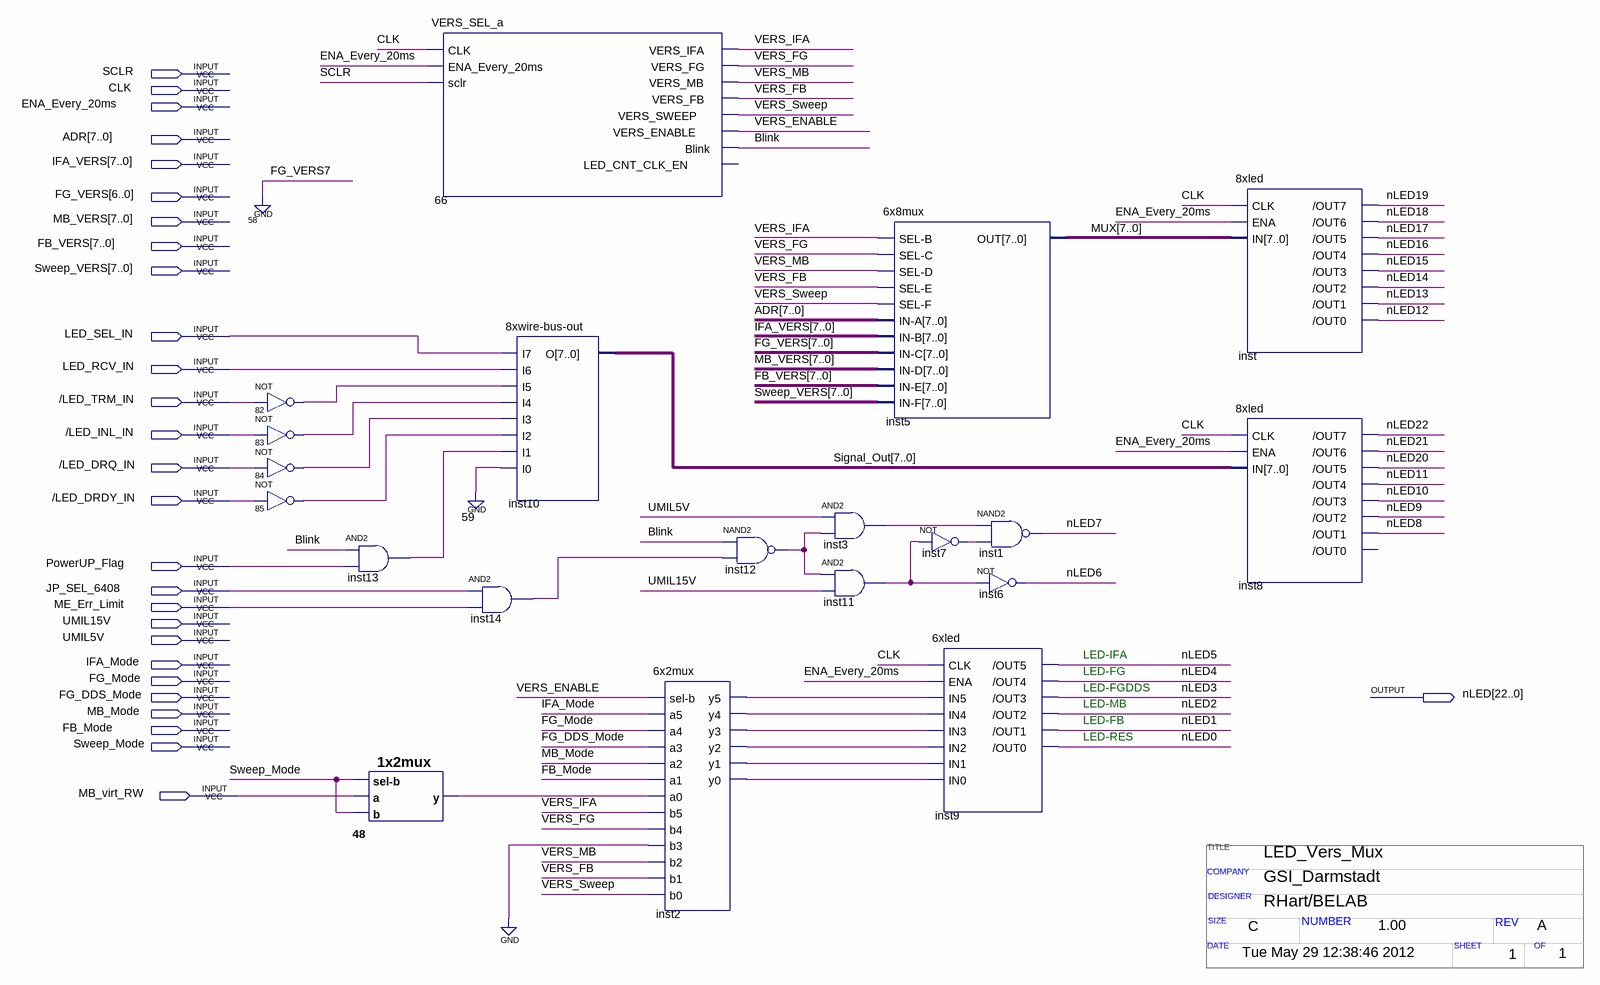
[diagram p0: schematic sheet]
// Quartus schematic led_vers_mux.bdf as structural Verilog: 20 symbols, 28 pins
// Title block: TITLE: LED_Vers_Mux; COMPANY: GSI_Darmstadt; DESIGNER: RHart/BELAB; SIZE: C; NUMBER: 1.00; REV: A; DATE: Tue May 29 12:38:46 2012; SHEET: 1; OF: 1
module led_vers_mux (
  input  SCLR,
  input  CLK,
  input  ENA_Every_20ms,
  input  [7:0] ADR,
  input  [7:0] IFA_VERS,
  input  [6:0] FG_VERS,
  input  [7:0] MB_VERS,
  input  [7:0] FB_VERS,
  input  [7:0] Sweep_VERS,
  input  LED_SEL_IN,
  input  LED_RCV_IN,
  input  \/LED_TRM_IN ,
  input  \/LED_INL_IN ,
  input  \/LED_DRQ_IN ,
  input  \/LED_DRDY_IN ,
  input  PowerUP_Flag,
  input  JP_SEL_6408,
  input  ME_Err_Limit,
  input  UMIL15V,
  input  UMIL5V,
  input  IFA_Mode,
  input  FG_Mode,
  input  FG_DDS_Mode,
  input  MB_Mode,
  input  FB_Mode,
  input  Sweep_Mode,
  input  MB_virt_RW,
  output [22:0] nLED
);

  wire Blink, inst2_y0, inst2_y1, inst2_y2, inst2_y3, inst2_y4, inst2_y5, inst3_out, inst7_out, inst11_out,
       inst12_out, inst13_out, inst14_out, n48_y, n82_out, n83_out, n84_out, n85_out, VERS_ENABLE, VERS_FB,
       VERS_FG, VERS_IFA, VERS_MB, VERS_Sweep;
  wire [7:0] MUX, Signal_Out;

  not u_82 (n82_out, \/LED_TRM_IN );
  not u_83 (n83_out, \/LED_INL_IN );
  not u_84 (n84_out, \/LED_DRQ_IN );
  not u_85 (n85_out, \/LED_DRDY_IN );
  and inst13 (inst13_out, Blink, PowerUP_Flag);
  \1x2mux  u_48 (.\sel-b (Sweep_Mode), .a(MB_virt_RW), .b(Sweep_Mode), .y(n48_y));
  VERS_SEL_a u_66 (
    .CLK(CLK), .ENA_Every_20ms(ENA_Every_20ms), .sclr(SCLR), .VERS_IFA(VERS_IFA), .VERS_FG(VERS_FG),
    .VERS_MB(VERS_MB), .VERS_FB(VERS_FB), .VERS_SWEEP(VERS_Sweep), .VERS_ENABLE(VERS_ENABLE), .Blink(Blink));  // open: LED_CNT_CLK_EN
  \8xwire-bus-out  inst10 (
    .I7(LED_SEL_IN), .I6(LED_RCV_IN), .I5(n82_out), .I4(n83_out), .I3(n84_out), .I2(n85_out),
    .I1(inst13_out), .I0(1'b0), .O(Signal_Out));
  and inst14 (inst14_out, JP_SEL_6408, ME_Err_Limit);
  \6x2mux  inst2 (
    .\sel-b (VERS_ENABLE), .a5(IFA_Mode), .a4(FG_Mode), .a3(FG_DDS_Mode), .a2(MB_Mode), .a1(FB_Mode),
    .a0(n48_y), .b5(VERS_IFA), .b4(VERS_FG), .b3(1'b0), .b2(VERS_MB), .b1(VERS_FB), .b0(VERS_Sweep),
    .y5(inst2_y5), .y4(inst2_y4), .y3(inst2_y3), .y2(inst2_y2), .y1(inst2_y1), .y0(inst2_y0));
  nand inst12 (inst12_out, Blink, inst14_out);
  and inst3 (inst3_out, UMIL5V, inst12_out);
  and inst11 (inst11_out, inst12_out, UMIL15V);
  \6x8mux  inst5 (
    .\SEL-B (VERS_IFA), .\SEL-C (VERS_FG), .\SEL-D (VERS_MB), .\SEL-E (VERS_FB), .\SEL-F (VERS_Sweep),
    .\IN-A (ADR), .\IN-B (IFA_VERS), .\IN-C ({1'b0, FG_VERS}), .\IN-D (MB_VERS), .\IN-E (FB_VERS),
    .\IN-F (Sweep_VERS), .OUT(MUX));
  not inst7 (inst7_out, inst11_out);
  nand inst1 (nLED[7], inst3_out, inst7_out);
  not inst6 (nLED[6], inst11_out);
  \6xled  inst9 (
    .CLK(CLK), .ENA(ENA_Every_20ms), .IN5(inst2_y5), .IN4(inst2_y4), .IN3(inst2_y3), .IN2(inst2_y2),
    .IN1(inst2_y1), .IN0(inst2_y0), .\/OUT5 (nLED[5]), .\/OUT4 (nLED[4]), .\/OUT3 (nLED[3]),
    .\/OUT2 (nLED[2]), .\/OUT1 (nLED[1]), .\/OUT0 (nLED[0]));
  \8xled  inst (
    .CLK(CLK), .ENA(ENA_Every_20ms), .IN(MUX), .\/OUT7 (nLED[19]), .\/OUT6 (nLED[18]), .\/OUT5 (nLED[17]),
    .\/OUT4 (nLED[16]), .\/OUT3 (nLED[15]), .\/OUT2 (nLED[14]), .\/OUT1 (nLED[13]), .\/OUT0 (nLED[12]));
  \8xled  inst8 (
    .CLK(CLK), .ENA(ENA_Every_20ms), .IN(Signal_Out), .\/OUT7 (nLED[22]), .\/OUT6 (nLED[21]),
    .\/OUT5 (nLED[20]), .\/OUT4 (nLED[11]), .\/OUT3 (nLED[10]), .\/OUT2 (nLED[9]), .\/OUT1 (nLED[8]));  // open: /OUT0

  // Notes on the sheet:
  //   LED-IFA
  //   LED-FG
  //   LED-FGDDS
  //   LED-MB
  //   LED-FB
  //   LED-RES
endmodule
